# Altium schematic sheet SDRAM.SchDoc: foxBMS BMS-Master
size A3; DocumentNumber: 22; SheetNumber: 22; SheetTotal: 24; Author: Fraunhofer IISB foxBMS Team; REL-DATE: 2017-05-16; VERSION: 1.0.2; SheetDescription: 8MB SDRAM
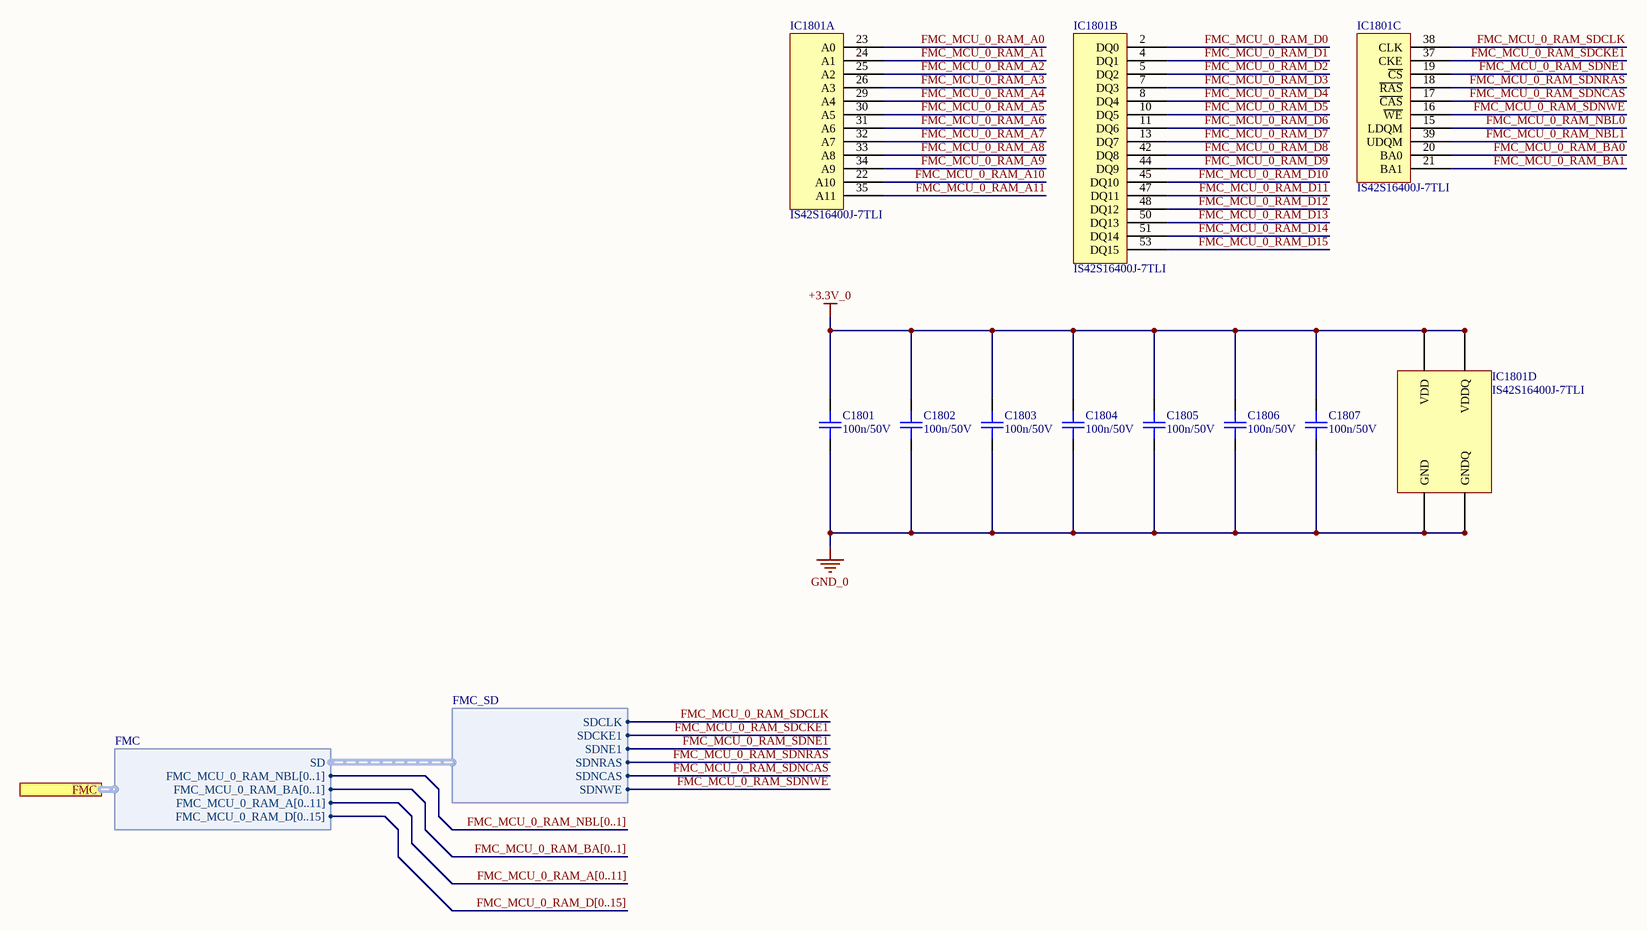
[diagram p0: SDRAM.SchDoc]

## Parts
C1801  100n/50V  [CAPC1608X08N]
C1802  100n/50V  [CAPC1608X08N]
C1803  100n/50V  [CAPC1608X08N]
C1804  100n/50V  [CAPC1608X08N]
C1805  100n/50V  [CAPC1608X08N]
C1806  100n/50V  [CAPC1608X08N]
C1807  100n/50V  [CAPC1608X08N]
IC1801  IS42S16400J-7TLI  [TSOP80P1180X120-54N]  (parts A,B,C,D of 4)

## Ports
FMC (harness FMC)

## Harnesses
FMC_SD: SDCLK, SDCKE1, SDNE1, SDNRAS, SDNWE, SDNCAS
FMC: SD, FMC_MCU_0_RAM_NBL[0..1], FMC_MCU_0_RAM_BA[0..1], FMC_MCU_0_RAM_A[0..11], FMC_MCU_0_RAM_D[0..15]

## Nets
+3.3V_0: C1801.1 C1802.1 C1803.1 C1804.1 C1805.1 C1806.1 C1807.1 IC1801.1(VDD) IC1801.3(VDDQ) IC1801.9(VDDQ) IC1801.14(VDD) IC1801.27(VDD) IC1801.43(VDDQ) IC1801.49(VDDQ)
GND_0: C1801.2 C1802.2 C1803.2 C1804.2 C1805.2 C1806.2 C1807.2 IC1801.6(GNDQ) IC1801.12(GNDQ) IC1801.28(GND) IC1801.41(GND) IC1801.46(GNDQ) IC1801.52(GNDQ) IC1801.54(GND)
FMC_MCU_0_RAM_A0: IC1801.23(A0)
FMC_MCU_0_RAM_A1: IC1801.24(A1)
FMC_MCU_0_RAM_A2: IC1801.25(A2)
FMC_MCU_0_RAM_A3: IC1801.26(A3)
FMC_MCU_0_RAM_A4: IC1801.29(A4)
FMC_MCU_0_RAM_A5: IC1801.30(A5)
FMC_MCU_0_RAM_A6: IC1801.31(A6)
FMC_MCU_0_RAM_A7: IC1801.32(A7)
FMC_MCU_0_RAM_A8: IC1801.33(A8)
FMC_MCU_0_RAM_A9: IC1801.34(A9)
FMC_MCU_0_RAM_A10: IC1801.22(A10)
FMC_MCU_0_RAM_A11: IC1801.35(A11)
FMC_MCU_0_RAM_BA0: IC1801.20(BA0)
FMC_MCU_0_RAM_BA1: IC1801.21(BA1)
FMC_MCU_0_RAM_D0: IC1801.2(DQ0)
FMC_MCU_0_RAM_D1: IC1801.4(DQ1)
FMC_MCU_0_RAM_D2: IC1801.5(DQ2)
FMC_MCU_0_RAM_D3: IC1801.7(DQ3)
FMC_MCU_0_RAM_D4: IC1801.8(DQ4)
FMC_MCU_0_RAM_D5: IC1801.10(DQ5)
FMC_MCU_0_RAM_D6: IC1801.11(DQ6)
FMC_MCU_0_RAM_D7: IC1801.13(DQ7)
FMC_MCU_0_RAM_D8: IC1801.42(DQ8)
FMC_MCU_0_RAM_D9: IC1801.44(DQ9)
FMC_MCU_0_RAM_D10: IC1801.45(DQ10)
FMC_MCU_0_RAM_D11: IC1801.47(DQ11)
FMC_MCU_0_RAM_D12: IC1801.48(DQ12)
FMC_MCU_0_RAM_D13: IC1801.50(DQ13)
FMC_MCU_0_RAM_D14: IC1801.51(DQ14)
FMC_MCU_0_RAM_D15: IC1801.53(DQ15)
FMC_MCU_0_RAM_NBL0: IC1801.15(LDQM)
FMC_MCU_0_RAM_NBL1: IC1801.39(UDQM)
FMC_MCU_0_RAM_SDCKE1: IC1801.37(CKE) ; harness FMC_SD.SDCKE1
FMC_MCU_0_RAM_SDCLK: IC1801.38(CLK) ; harness FMC_SD.SDCLK
FMC_MCU_0_RAM_SDNCAS: IC1801.17(~{CAS}) ; harness FMC_SD.SDNCAS
FMC_MCU_0_RAM_SDNE1: IC1801.19(~{CS}) ; harness FMC_SD.SDNE1
FMC_MCU_0_RAM_SDNRAS: IC1801.18(~{RAS}) ; harness FMC_SD.SDNRAS
FMC_MCU_0_RAM_SDNWE: IC1801.16(~{WE}) ; harness FMC_SD.SDNWE

## Buses and harness runs
bus FMC_MCU_0_RAM_A[0..11]
bus FMC_MCU_0_RAM_BA[0..1]
bus FMC_MCU_0_RAM_D[0..15]
bus FMC_MCU_0_RAM_NBL[0..1]

## Notes on the sheet
- Fraunhofer IISB
- Schottkystr. 10
- developed by:
- 91058 Erlangen
- Germany
- Author
- Project
- License
- Description
- File
- Version
- Release Date
- Sheet
- www.foxbms.org
- www.iisb.fraunhofer.de
- foxBMS Team
- /

## Library data of the parts
C1801-C1807 = gen_C_ceramic_100n_50V_X7R_0603: MLCC; Capacitance: 100n; Rated Voltage: 50V; Dielectric: X7R; Case EIA: 0603; Case Metric: 1608; PnP Package: C_0603_10; PnP Value: 100n/50V/X7R; PnP equipped: x; Automotive Qualified: False; Part Number: gen_C_ceramic_100n_50V_X7R_0603; Supplier 1: Farnell; Supplier Part Number 1: 2525267; Supplier 2: Digikey; Supplier Part Number 2: 490-6049-1-ND
IC1801 = IS42S16400J-7TLI: SDRAM, 4M x 16 Bit; Manufacturer: INTEGRATED SILICON SOLUTION (ISSI); PnP Package: TSOP II; Automotive Qualified: True; Part Number: IS42S16400J-7TLI; Part Name: IS42S16400J-7TLI; Operating Temperature: -40 / o / C to +85 / o / -40°C - +85°C; ComponentLink1Description: Datasheet; ComponentLink1URL: http://www.farnell.com/datasheets/1674895.pdf; Supplier 1: Farnell; Supplier Part Number 1: 2253831